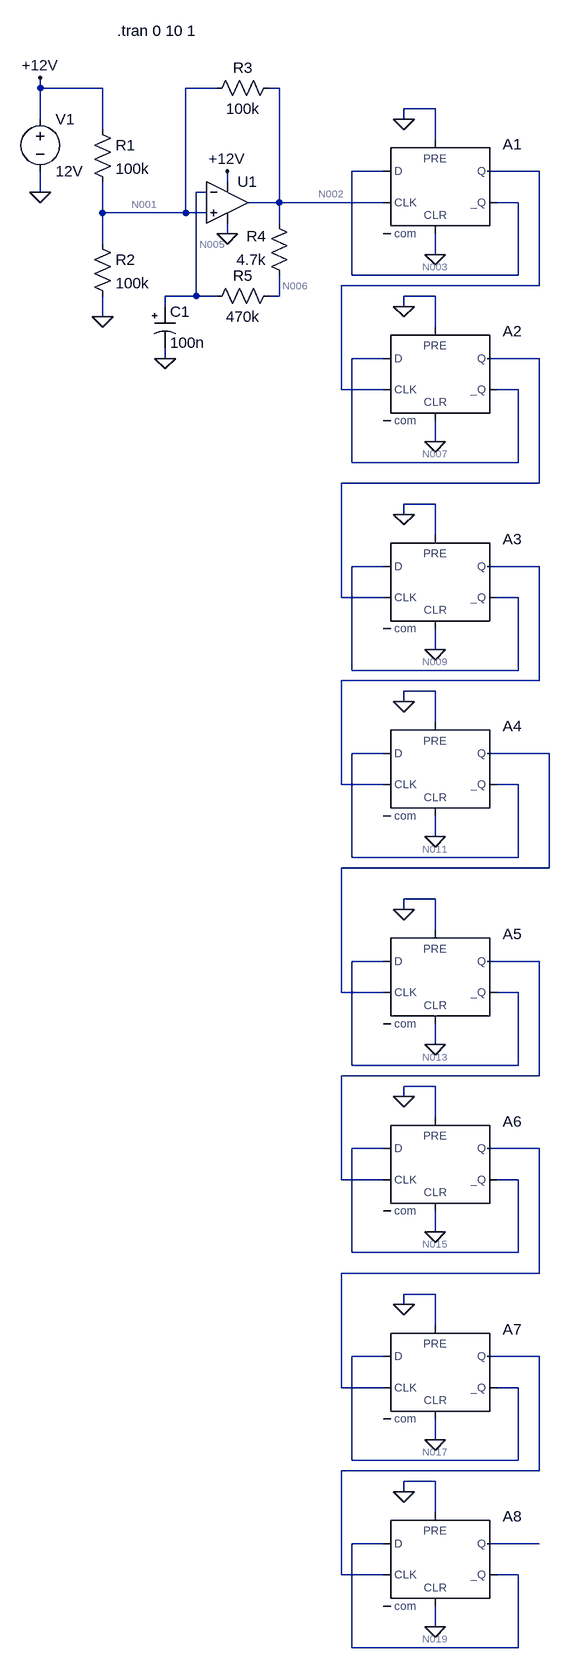
[diagram p0: schematic Draft1.asc]
Draft1.asc, the LTspice schematic file:
Version 4
SHEET 1 880 2404
WIRE -48 0 -48 -16
WIRE 48 0 -48 0
WIRE 224 0 176 0
WIRE 320 0 304 0
WIRE 560 32 512 32
WIRE -48 48 -48 0
WIRE 512 48 512 32
WIRE 48 64 48 0
WIRE 560 80 560 32
WIRE 480 128 432 128
WIRE 720 128 640 128
WIRE 240 144 240 128
WIRE -48 160 -48 128
WIRE 208 160 192 160
WIRE 320 176 320 0
WIRE 320 176 272 176
WIRE 480 176 320 176
WIRE 688 176 656 176
WIRE 48 192 48 144
WIRE 176 192 176 0
WIRE 176 192 48 192
WIRE 208 192 176 192
WIRE 320 208 320 176
WIRE 240 224 240 208
WIRE 48 240 48 192
WIRE 560 256 560 224
WIRE 432 288 432 128
WIRE 688 288 688 176
WIRE 688 288 432 288
WIRE 720 304 720 128
WIRE 720 304 416 304
WIRE 192 320 192 160
WIRE 192 320 144 320
WIRE 224 320 192 320
WIRE 320 320 320 288
WIRE 320 320 304 320
WIRE 560 320 512 320
WIRE 144 336 144 320
WIRE 512 336 512 320
WIRE 48 352 48 320
WIRE 560 368 560 320
WIRE 144 416 144 400
WIRE 480 416 432 416
WIRE 720 416 640 416
WIRE 416 464 416 304
WIRE 480 464 416 464
WIRE 688 464 656 464
WIRE 560 544 560 512
WIRE 432 576 432 416
WIRE 688 576 688 464
WIRE 688 576 432 576
WIRE 720 608 720 416
WIRE 720 608 416 608
WIRE 560 640 512 640
WIRE 512 656 512 640
WIRE 560 688 560 640
WIRE 480 736 432 736
WIRE 720 736 640 736
WIRE 416 784 416 608
WIRE 480 784 416 784
WIRE 688 784 656 784
WIRE 560 864 560 832
WIRE 432 896 432 736
WIRE 688 896 688 784
WIRE 688 896 432 896
WIRE 720 912 720 736
WIRE 720 912 416 912
WIRE 560 928 512 928
WIRE 512 944 512 928
WIRE 560 976 560 928
WIRE 480 1024 432 1024
WIRE 736 1024 640 1024
WIRE 416 1072 416 912
WIRE 480 1072 416 1072
WIRE 688 1072 656 1072
WIRE 560 1152 560 1120
WIRE 432 1184 432 1024
WIRE 688 1184 688 1072
WIRE 688 1184 432 1184
WIRE 736 1200 736 1024
WIRE 736 1200 416 1200
WIRE 560 1248 512 1248
WIRE 512 1264 512 1248
WIRE 560 1296 560 1248
WIRE 480 1344 432 1344
WIRE 720 1344 640 1344
WIRE 416 1392 416 1200
WIRE 480 1392 416 1392
WIRE 688 1392 656 1392
WIRE 560 1472 560 1440
WIRE 432 1504 432 1344
WIRE 688 1504 688 1392
WIRE 688 1504 432 1504
WIRE 720 1520 720 1344
WIRE 720 1520 416 1520
WIRE 560 1536 512 1536
WIRE 512 1552 512 1536
WIRE 560 1584 560 1536
WIRE 480 1632 432 1632
WIRE 720 1632 640 1632
WIRE 416 1680 416 1520
WIRE 480 1680 416 1680
WIRE 688 1680 656 1680
WIRE 560 1760 560 1728
WIRE 432 1792 432 1632
WIRE 688 1792 688 1680
WIRE 688 1792 432 1792
WIRE 720 1824 720 1632
WIRE 720 1824 416 1824
WIRE 560 1856 512 1856
WIRE 512 1872 512 1856
WIRE 560 1904 560 1856
WIRE 480 1952 432 1952
WIRE 720 1952 640 1952
WIRE 416 2000 416 1824
WIRE 480 2000 416 2000
WIRE 688 2000 656 2000
WIRE 560 2080 560 2048
WIRE 432 2112 432 1952
WIRE 688 2112 688 2000
WIRE 688 2112 432 2112
WIRE 720 2128 720 1952
WIRE 720 2128 416 2128
WIRE 560 2144 512 2144
WIRE 512 2160 512 2144
WIRE 560 2192 560 2144
WIRE 480 2240 432 2240
WIRE 720 2240 640 2240
WIRE 416 2288 416 2128
WIRE 480 2288 416 2288
WIRE 688 2288 656 2288
WIRE 560 2368 560 2336
WIRE 432 2400 432 2240
WIRE 688 2400 688 2288
WIRE 688 2400 432 2400
FLAG -48 160 0
FLAG -48 -16 +12V
FLAG 240 224 0
FLAG 240 128 +12V
FLAG 144 416 0
FLAG 48 352 0
FLAG 512 48 0
FLAG 560 256 0
FLAG 512 336 0
FLAG 560 544 0
FLAG 512 656 0
FLAG 560 864 0
FLAG 512 944 0
FLAG 560 1152 0
FLAG 512 1264 0
FLAG 560 1472 0
FLAG 512 1552 0
FLAG 560 1760 0
FLAG 512 1872 0
FLAG 560 2080 0
FLAG 512 2160 0
FLAG 560 2368 0
SYMBOL voltage -48 32 R0
SYMATTR InstName V1
SYMATTR Value 12V
SYMBOL res 32 48 R0
SYMATTR InstName R1
SYMATTR Value 100k
SYMBOL res 32 224 R0
SYMATTR InstName R2
SYMATTR Value 100k
SYMBOL res 320 -16 R90
WINDOW 0 0 56 VBottom 2
WINDOW 3 32 56 VTop 2
SYMATTR InstName R3
SYMATTR Value 100k
SYMBOL res 336 304 R180
WINDOW 0 36 76 Left 2
WINDOW 3 36 40 Left 2
SYMATTR InstName R4
SYMATTR Value 4.7k
SYMBOL res 208 336 R270
WINDOW 0 32 56 VTop 2
WINDOW 3 0 56 VBottom 2
SYMATTR InstName R5
SYMATTR Value 470k
SYMBOL polcap 128 336 R0
WINDOW 3 24 56 Left 2
SYMATTR InstName C1
SYMATTR Value 100n
SYMATTR Description Capacitor
SYMATTR Type cap
SYMATTR SpiceLine V=50 Irms=12m Rser=22 Lser=0 mfg="Nichicon" pn="UPR1H010MAH" type="Al electrolytic"
SYMBOL Opamps\\UniversalOpamp2 240 176 R0
SYMATTR InstName U1
SYMBOL Digital\\dflop 560 80 R0
SYMATTR InstName A1
SYMATTR Value ""
SYMBOL Digital\\dflop 560 368 R0
SYMATTR InstName A2
SYMATTR Value ""
SYMBOL Digital\\dflop 560 688 R0
SYMATTR InstName A3
SYMATTR Value ""
SYMBOL Digital\\dflop 560 976 R0
SYMATTR InstName A4
SYMATTR Value ""
SYMBOL Digital\\dflop 560 1296 R0
SYMATTR InstName A5
SYMATTR Value ""
SYMBOL Digital\\dflop 560 1584 R0
SYMATTR InstName A6
SYMATTR Value ""
SYMBOL Digital\\dflop 560 1904 R0
SYMATTR InstName A7
SYMATTR Value ""
SYMBOL Digital\\dflop 560 2192 R0
SYMATTR InstName A8
SYMATTR Value ""
TEXT 70 -88 Left 2 !.tran 0 10 1

The netlist it stands for:
* Draft1.asc
V1 +12V 0 12V
R1 +12V N001 100k
R2 N001 0 100k
R3 N002 N001 100k
R4 N006 N002 4.7k
R5 N005 N006 470k
C1 N005 0 100n V=50 Irms=12m Rser=22 Lser=0 mfg="Nichicon" pn="UPR1H010MAH" type="Al electrolytic"
XU1 N001 N005 +12V 0 N002 level.2 Avol=1Meg GBW=10Meg Slew=10Meg ilimit=25m rail=0 Vos=0 phimargin=45 en=0 enk=0 in=0 ink=0 Rin=500Meg  ; pins IN+ IN- V+ V- OUT
A1 N003 0 N002 0 0 N003 N004 0 DFLOP
A2 N007 0 N004 0 0 N007 N008 0 DFLOP
A3 N009 0 N008 0 0 N009 N010 0 DFLOP
A4 N011 0 N010 0 0 N011 N012 0 DFLOP
A5 N013 0 N012 0 0 N013 N014 0 DFLOP
A6 N015 0 N014 0 0 N015 N016 0 DFLOP
A7 N017 0 N016 0 0 N017 N018 0 DFLOP
A8 N019 0 N018 0 0 N019 N020 0 DFLOP
.tran 0 10 1
.lib UniversalOpamps2.sub
.backanno
.end

* Results of the author's LTspice run, read from the files saved beside the schematic
* Operating Point, zero values left out:
*   V(+12v) = 12 V
*   V(n001) = 6 V
*   V(n002) = 6 V
*   V(n006) = 6 V
*   V(n005) = 6 V
*   V(n003) = 1 V
*   V(n007) = 1 V
*   V(n009) = 1 V
*   V(n011) = 1 V
*   V(n013) = 1 V
*   V(n015) = 1 V
*   V(n017) = 1 V
*   V(n019) = 1 V
*   I(R2) = 60 µA
*   I(R1) = 60 µA
*   I(V1) = -659.7 µA
*   Ix(u1:3) = 599.9 µA
*   Ix(u1:4) = -599.9 µA
*   Ix(u1:5) = 6.537 nA